# Altium project T1-T0ast.X1.PrjPcb (part 1 of 2)
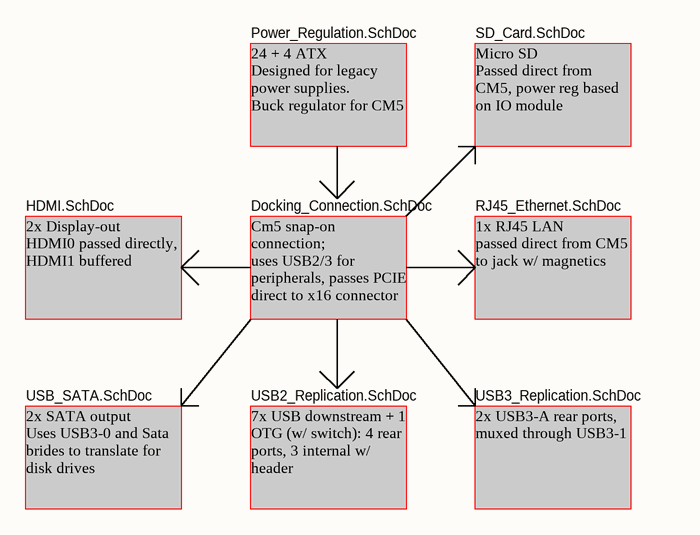
[diagram p0: Block Diagram.SchDoc]
9 sheets, 380 parts. Net scope: global (net labels, ports and power ports of the same name join across sheets).
Board file: T1-T0ast.PcbDoc
Sheets:
  Block Diagram.SchDoc
    12VDC, 5VDC, 5VDC. 3VDC, 1.2VDC = Power_Regulation.SchDoc
    12VDC, 5VDC, 5VDC. 3VDC, 1.2VDC = USB2_Replication.SchDoc
    12VDC, 5VDC, 5VDC. 3VDC, 1.2VDC = Docking_Connection.SchDoc
    12VDC, 5VDC, 5VDC. 3VDC, 1.2VDC = RJ45_Ethernet.SchDoc
    12VDC, 5VDC, 5VDC. 3VDC, 1.2VDC = HDMI.SchDoc
    12VDC, 5VDC, 5VDC. 3VDC, 1.2VDC = USB_SATA.SchDoc
    12VDC, 5VDC, 5VDC. 3VDC, 1.2VDC = USB3_Replication.SchDoc
  USB_Audio.SchDoc

## Sheet Block Diagram.SchDoc
size A; SheetNumber: 1; SheetTotal: 9; CompanyName: Gamber-Johnson LLC; Organization: CD Cell

### Sub-sheets
12VDC, 5VDC, 5VDC. 3VDC, 1.2VDC = Power_Regulation.SchDoc: no entries
12VDC, 5VDC, 5VDC. 3VDC, 1.2VDC = USB2_Replication.SchDoc: no entries
12VDC, 5VDC, 5VDC. 3VDC, 1.2VDC = Docking_Connection.SchDoc: no entries
12VDC, 5VDC, 5VDC. 3VDC, 1.2VDC = RJ45_Ethernet.SchDoc: no entries
12VDC, 5VDC, 5VDC. 3VDC, 1.2VDC = HDMI.SchDoc: no entries
12VDC, 5VDC, 5VDC. 3VDC, 1.2VDC = USB_SATA.SchDoc: no entries
12VDC, 5VDC, 5VDC. 3VDC, 1.2VDC = SD_Card.SchDoc (file not in this document): no entries
12VDC, 5VDC, 5VDC. 3VDC, 1.2VDC = USB3_Replication.SchDoc: no entries

### Notes on the sheet
- 24 + 4 ATX
  Designed for legacy power supplies.
  Buck regulator for CM5
- Micro SD
  Passed direct from CM5, power reg based on IO module
- 2x Display-out
  HDMI0 passed directly, HDMI1 buffered
- Cm5 snap-on connection;
  uses USB2/3 for peripherals, passes PCIE direct to x16 connector
- 1x RJ45 LAN
  passed direct from CM5 to jack w/ magnetics
- 2x SATA output
  Uses USB3-0 and Sata brides to translate for disk drives
- 7x USB downstream + 1 OTG (w/ switch): 4 rear ports, 3 internal w/ header
- 2x USB3-A rear ports, muxed through USB3-1
- REV
- REVISIONS
- DATE
- DESCRIPTION
- BY
- UNLESS OTHERWISE SPECIFIED, DRAWING DEFINITIONS AND TOLERANCES SHALL BE FOUND UNDER SUPPLIER STANDARDS SS-001. THIS PART AND ALL COMPONENTS OF IT MUST BE RoHS & REACH COMPLIANT. A CERTIFICATE OF COMPLIANCE MUST BE PROVIDED UPON REQUEST.
- ALL INFORMATION ON THIS DOCUMENT IS THE SOLE PROPERTY OF GAMBER-JOHNSON AND SHALL NOT BE COPIED, REPRODUCED, USED OR DISCLOSED IN WHOLE OR IN PART WITHOUT THE WRITTEN CONSENT OF GAMBER-JOHNSON
- TOLERANCES
  .00 ± .060
  .000 ± .020
  .0000 ± .005
  ANGELS ± 1°
- DRAWN BY:
- PROJECT NUMBER:
- SHEET TITLE:
- SHEET
- OF
- DATE:
- LOCATION:
- ASSEMBLY NUMBER
- SIZE
- GAMBER-JOHNSON LLC
  5001 Joerns Dr
  STEVENS POINT, WI 54481
  +1 (715) 344-5209
- A

## Sheet Power_Regulation.SchDoc
size A; SheetNumber: 2; SheetTotal: 10
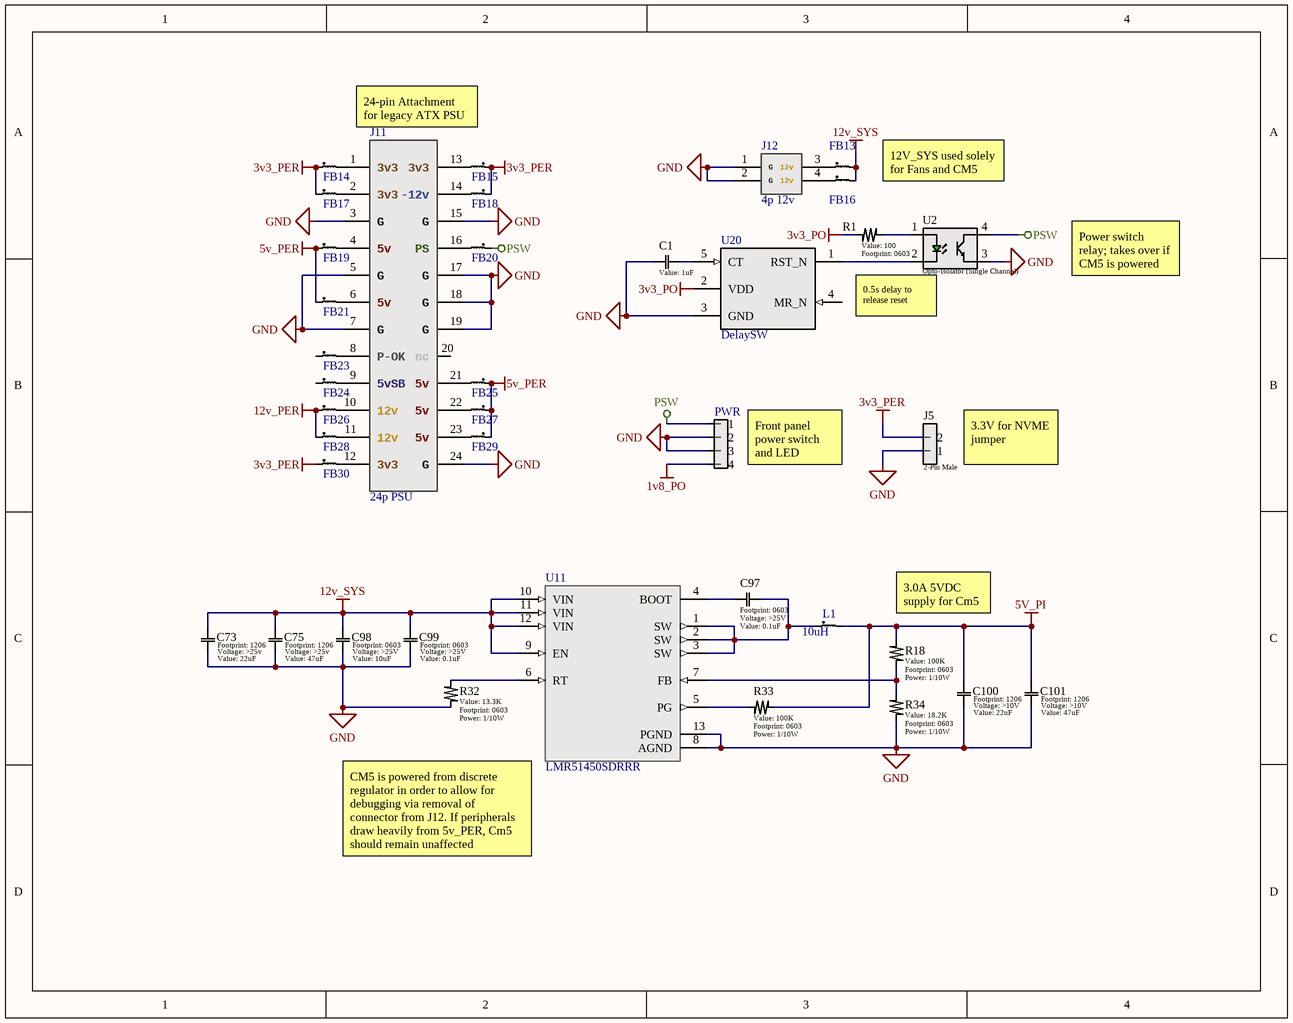
[diagram p1: Power_Regulation.SchDoc]

### Parts
C1  value 1uF  [0603]  (hidden comment: Generic Capacitor)
C73  value 22uF  Voltage: >25v  [1206]  (hidden comment: Generic Capacitor)
C75  value 47uF  Voltage: >25v  [1206]  (hidden comment: Generic Capacitor)
C97  value 0.1uF  Voltage: >25V  [0603]  (hidden comment: Generic Capacitor)
C98  value 10uF  Voltage: >25V  [0603]  (hidden comment: Generic Capacitor)
C99  value 0.1uF  Voltage: >25V  [0603]  (hidden comment: Generic Capacitor)
C100  value 22uF  Voltage: >10V  [1206]  (hidden comment: Generic Capacitor)
C101  value 47uF  Voltage: >10V  [1206]  (hidden comment: Generic Capacitor)
FB13  1206 Ferrite  [1206]  (value not drawn)
FB14  1206 Ferrite  [1206]  (value not drawn)
FB15  1206 Ferrite  [1206]  (value not drawn)
FB16  1206 Ferrite  [1206]  (value not drawn)
FB17  1206 Ferrite  [1206]  (value not drawn)
FB18  1206 Ferrite  [1206]  (value not drawn)
FB19  1206 Ferrite  [1206]  (value not drawn)
FB20  1206 Ferrite  [1206]  (value not drawn)
FB21  1206 Ferrite  [1206]  (value not drawn)
FB23  1206 Ferrite  [1206]  (value not drawn)
FB24  1206 Ferrite  [1206]  (value not drawn)
FB25  1206 Ferrite  [1206]  (value not drawn)
FB26  1206 Ferrite  [1206]  (value not drawn)
FB27  1206 Ferrite  [1206]  (value not drawn)
FB28  1206 Ferrite  [1206]  (value not drawn)
FB29  1206 Ferrite  [1206]  (value not drawn)
FB30  1206 Ferrite  [1206]  (value not drawn)
J5  2-Pin Male  [0022057025]
J11  24p PSU  [CONN_442060007_MOL]
J12  4p 12v  [CON_39281043]
L1  10uH  [SMD 8.2x8.6mm]
PWR  4-Pin Male Header (0.100" Pitch)  [TSW-104-07-T-S]  (value not drawn)
R1  value 100  [0603]  (hidden comment: Generic Resistor)
R18  value 100K  Power: 1/10W  [0603]  (hidden comment: Generic Resistor)
R32  value 13.3K  Power: 1/10W  [0603]  (hidden comment: Generic Resistor)
R33  value 100K  Power: 1/10W  [0603]  (hidden comment: Generic Resistor)
R34  value 18.2K  Power: 1/10W  [0603]  (hidden comment: Generic Resistor)
U2  Opto-Isolator (Single Channel)  [4-SMD (7.62mm Gull-Wing) Opto-Transistor]
U11  LMR51450SDRRR  [WSON-12]
U20  DelaySW  [TSOT-23-5]

### Nets
1v8_PO: PWR.4
3v3_PER: FB14.1 FB15.1 FB17.1 FB18.1 FB30.1 J5.2
3v3_PO: R1.1 U20.2(VDD)
5v_PER: FB19.1 FB21.1 FB25.1 FB27.1 FB29.1
5V_PI: C100.1 C101.1 L1.2 R18.2 R33.1
12v_PER: FB26.1 FB28.1
12v_SYS: C73.1 C75.1 C98.1 C99.1 FB13.2 FB16.2 U11.9(EN) U11.10(VIN) U11.11(VIN) U11.12(VIN)
GND: C1.2 C73.2 C75.2 C98.2 C99.2 C100.2 C101.2 J5.1 J11.3(G) J11.5(G) J11.7(G) J11.15(G) J11.17(G) J11.18(G) J11.19(G) J11.24(G) J12.1(G) J12.2(G) PWR.2 PWR.3 R32.1 R34.1 U2.3 U11.8(AGND) U11.13(PGND) U20.3(GND)
PSW: FB20.1 PWR.1 U2.4
NetC1_1: C1.1 U20.5(CT)
NetC97_1: C97.1 U11.4(BOOT)
NetC97_2: C97.2 L1.1 U11.1(SW) U11.2(SW) U11.3(SW)
NetFB13_1: FB13.1 J12.3(12v)
NetFB14_2: FB14.2 J11.1(3v3)
NetFB15_2: FB15.2 J11.13(3v3)
NetFB16_1: FB16.1 J12.4(12v)
NetFB17_2: FB17.2 J11.2(3v3)
NetFB18_2: FB18.2 J11.14(-12v)
NetFB19_2: FB19.2 J11.4(5v)
NetFB20_2: FB20.2 J11.16(PS)
NetFB21_2: FB21.2 J11.6(5v)
NetFB23_2: FB23.2 J11.8(P-OK)
NetFB24_2: FB24.2 J11.9(5vSB)
NetFB25_2: FB25.2 J11.21(5v)
NetFB26_2: FB26.2 J11.10(12v)
NetFB27_2: FB27.2 J11.22(5v)
NetFB28_2: FB28.2 J11.11(12v)
NetFB29_2: FB29.2 J11.23(5v)
NetFB30_2: FB30.2 J11.12(3v3)
NetR1_2: R1.2 U2.1
NetR18_1: R18.1 R34.2 U11.7(FB)
NetR32_2: R32.2 U11.6(RT)
NetR33_2: R33.2 U11.5(PG)
NetU2_2: U2.2 U20.1(RST_N)

Not connected (* = marked no-connect by the designer): FB23 1; FB24 1; J11 20(nc); U20 4(MR_N)

### Notes on the sheet
- 24-pin Attachment for legacy ATX PSU
- 12V_SYS used solely for Fans and CM5
- Power switch relay; takes over if CM5 is powered
- (near U2) 0.5s delay to release reset
- (near PWR) Front panel power switch and LED
- (near J5) 3.3V for NVME jumper
- (near R18) 3.0A 5VDC supply for Cm5
- (near U11) CM5 is powered from discrete regulator in order to allow for debugging via removal of connector from J12. If peripherals draw heavily from 5v_PER, Cm5 should remain unaffected
- REV
- REVISIONS
- DATE
- DESCRIPTION
- BY
- UNLESS OTHERWISE SPECIFIED, DRAWING DEFINITIONS AND TOLERANCES SHALL BE FOUND UNDER SUPPLIER STANDARDS SS-001. THIS PART AND ALL COMPONENTS OF IT MUST BE RoHS & REACH COMPLIANT. A CERTIFICATE OF COMPLIANCE MUST BE PROVIDED UPON REQUEST.
- ALL INFORMATION ON THIS DOCUMENT IS THE SOLE PROPERTY OF GAMBER-JOHNSON AND SHALL NOT BE COPIED, REPRODUCED, USED OR DISCLOSED IN WHOLE OR IN PART WITHOUT THE WRITTEN CONSENT OF GAMBER-JOHNSON
- TOLERANCES
  .00 ± .060
  .000 ± .020
  .0000 ± .005
  ANGELS ± 1°
- DRAWN BY:
- PROJECT NUMBER:
- SHEET TITLE:
- SHEET
- OF
- DATE:
- LOCATION:
- ASSEMBLY NUMBER
- SIZE
- GAMBER-JOHNSON LLC
  5001 JOERNS DR.
  STEVENS POINT, WI 54481
  +1 (715) 344-5209
- B

### Library data of the parts
C1 = Generic Capacitor: Voltage: 10V; Tolerance: 10%
C73 C75 C100 = Generic Capacitor: Tolerance: 20%
C97-C99 C101 = Generic Capacitor: Tolerance: 10%
FB13-FB21 FB23-FB30 = HI1206T161R-10: 160 Ohms @ 100MHz 1 Power, Signal Line Ferrite Bead 1206 (3216 Metric) 6A 18mOhm; Manufacturer 1: Laird Steward; DC Resistance (DCR): 18mR; Number of Lines: 1; Impedance: 160R; Supplier 1: Digi-Key; Manufacturer Part Number 1: HI1206T161R-10; RoHS: Yes; Category: Fixed Inductors; Stock 1: 250713; Pricing 1: 1=0.20000, 10=0.15600, 25=0.12920, 50=0.11140, 100=0.10020, 250=0.08464, 500=0.07572, 1000=0.06458 (USD); Mount: Surface Mount; Case/Package: 1206; Weight: 0.0136oz; Case Code (Metric): 3216; Case Code (Imperial): 1206; Core Material: Ferrite; Material: Ferrite; Min Operating Temperature: -40°C; Max Operating Temperature: 125°C; Package Quantity: 1; Packaging: Tape and Reel; Max Current Rating: 6A; Current Rating: 6A; Max DC Current: 6A; Termination: SMD/SMT; Frequency: 100MHz; Test Frequency: 100MHz; Length: 3.2mm; Height: 0.071inch; Width: 0.063inch; Depth: 1.8mm; Lead Free: Lead Free; REACH SVHC: Unknown; ComponentLink1URL: https://datasheet.ciiva.com/22622/1685743-22622771.pdf?src-supplier=Element14; ComponentLink1Description: https://datasheet.ciiva.com/22622/1685743-22622771.pdf?src-supplier=Element14; ComponentLink2URL: https://datasheet.ciiva.com/16714/70065439-16714326.pdf?src-supplier=Allied+Electronics; ComponentLink2Description: https://datasheet.ciiva.com/16714/70065439-16714326.pdf?src-supplier=Allied+Electronics; Supplier Part Number 1: 240-2411-1-ND; LCSC PN: C2926396
J5 = 0022057025: Conn Shrouded Header (4 Sides) HDR 2 POS 2.5mm Solder RA Thru-Hole SPOX™ Bag; Manufacturer 1: Molex; Number of Poles: 2; Voltage Rating: 250V; Contact Resistance: 20mR; Max Voltage Rating (DC): 250.25kV; Max Voltage Rating (AC): 125V; Current Rating: 3A; Insulation Resistance: 1GR; Connector Type: Male Pin; Shrouded: Yes (With); Test Voltage: 1kV; Glow Wire Compliant: Non-compliant; Supplier 1: RSComponents; Manufacturer Part Number 1: 22-05-7025; RoHS: Yes; Category: Headers and Wire Housings; Stock 1: 1440; Pricing 1: 10=0.40100, 250=0.36000, 1000=0.24900, 5000=0.22200, 10000=0.20700 (USD); Mount: Through Hole,Surface Mount; Contact Plating: Tin,Copper; Contact Material: Brass,Bronze; Housing Color: Natural; Housing Material: Nylon; Color: Natural; Material: Nylon,Polyamide; Insulation Material: Nylon; Min Operating Temperature: -40°C; Max Operating Temperature: 105°C; Packaging: Bulk; Gender: Male; Number of Rows: 1; Termination: Solder; Number of Contacts: 2; Orientation: Right Angle; Package Quantity: 1; Voltage Rating (AC): 250V; Number of Positions: 2; Working Voltage: 250V; Voltage Rating (DC): 250V; Number of Circuits: 2; Contact Gender: Male; Series: SPOX™ 5268; Contact Type: Male Pin; Length: 7.65mm; Height: 5.7mm; Pitch: 2.5mm; Depth: 5.1mm; Lead Pitch: 2.5mm; Contact Mating Length: 0.138inch; Radiation Hardening: No; RoHS Compliant: Yes; REACH SVHC: Unknown; Lead Free: Lead Free; Flammability Rating: UL94 V-0; ComponentLink1URL: https://datasheet.ciiva.com/711/022057025-sd-711958.pdf?src-supplier=Digi-Key; ComponentLink1Description: https://datasheet.ciiva.com/711/022057025-sd-711958.pdf?src-supplier=Digi-Key; ComponentLink2URL: https://datasheet.ciiva.com/25265/1766960-25265813.pdf?src-supplier=Newark; ComponentLink2Description: https://datasheet.ciiva.com/25265/1766960-25265813.pdf?src-supplier=Newark; ComponentLink3URL: https://datasheet.ciiva.com/5155/0022057025-pcb-headers-158480-5155683.pdf?src-supplier=Mouser; ComponentLink3Description: https://datasheet.ciiva.com/5155/0022057025-pcb-headers-158480-5155683.pdf?src-supplier=Mouser; ComponentLink4URL: https://datasheet.ciiva.com/19461/2017869-19461071.pdf?src-supplier=Jameco; ComponentLink4Description: https://datasheet.ciiva.com/19461/2017869-19461071.pdf?src-supplier=Jameco; ComponentLink5URL: https://datasheet.ciiva.com/11747/0900766b80da772b-11747276.pdf?src-supplier=RSComponents; ComponentLink5Description: https://datasheet.ciiva.com/11747/0900766b80da772b-11747276.pdf?src-supplier=RSComponents; ComponentLink6URL: https://datasheet.ciiva.com/7920/1877911-7920684.pdf?src-supplier=Element14; ComponentLink6Description: https://datasheet.ciiva.com/7920/1877911-7920684.pdf?src-supplier=Element14; ComponentLink7URL: https://datasheet.ciiva.com/9468/0022057025-pcb-headers-9468379.pdf?src-supplier=Avnet; ComponentLink7Description: https://datasheet.ciiva.com/9468/0022057025-pcb-headers-9468379.pdf?src-supplier=Avnet; Supplier Part Number 1: 6878086; LCSC PN: C918490
J11 = 442060007: Connector Header Through Hole 24 position 0.165" (4.20mm); Mfr_Name: Molex Connector Corporation; RefDes: RefDes; Type: Type; Supplier 1: Mouser; Supplier Part Number 1: 538-44206-0007; LCSC PN: C7541562
J12 = 39281043: Connector Header Through Hole 4 position 0.165" (4.20mm); Mfr_Name: Molex Connector Corporation; RefDes: RefDes; Type: Type; Supplier 1: Avnet; Supplier Part Number 1: 0039281043; LCSC PN: C2845777
L1 = IHLP3232DZER100M5A: 5.1A 10uH ±20% 5.2A - Power Inductor; Mfr_Name: Vishay; Type: DEV; Copyright: Copyright (C) 2023 Ultra Librarian. All rights reserved.; Manufacturer_Part_Number: IHLP3232DZER100M5A; RefDes: RefDes; LCSC PN: C2051768; Supplier 1: Mouser
PWR = TSW-104-07-T-S: Connector Header Through Hole 4 position 0.100" (2.54mm); Manufacturer 1: Samtec; Manufacturer Part Number 1: MTSW-104-07-T-S-170; Number of Contacts: 4; Supplier 1: Avnet; RoHS: Yes; Category: Connectors; Mount: Through Hole; Contact Plating: Tin; Contact Material: Bronze; Min Operating Temperature: -55°C; Max Operating Temperature: 105°C; Number of Rows: 1; Termination: Solder; Gender: Male; Packaging: Bulk; Orientation: Vertical; Pitch: 2.54mm; Radiation Hardening: No; RoHS Compliant: Yes; Lead Free: Lead Free; ComponentLink1URL: http://www.samtec.com/documents/webfiles/pdf/HMTSW.PDF?src-supplier=Avnet; ComponentLink1Description: http://www.samtec.com/documents/webfiles/pdf/HMTSW.PDF?src-supplier=Avnet; Supplier Part Number 1: MTSW-104-07-T-S-170
R1 = Generic Resistor: Tolerance: 1%; Power: 1/10W
R18 R32-R34 = Generic Resistor: Tolerance: 1%
U2 = LTV-816S: LTV Series Single Channel 80 V 5000 Vrms Transistor Output Optocoupler SMT-DIP-4; Manufacturer: Vishay Lite-On; Manufacturer Part Number: LTV-816S-TA1; Number of Channels: 1; Forward Voltage: 1.4V; Collector Emitter Voltage (VCEO): 80V; Rise Time: 18000ns; Output Current per Channel: 50mA; Collector Emitter Saturation Voltage: 200mV; Current Transfer Ratio: 320%; Isolation Voltage: 5kV; Input Type: DC; Max Power Dissipation: 200mW; Reverse Breakdown Voltage: 6V; Supplier 1: Digi-Key; RoHS: Yes; Category: Optocouplers; Stock 1: 2; Pricing 1: 1=0.45000, 10=0.27600, 100=0.15870 (USD); Mount: Surface Mount; Case/Package: SMD/SMT; Number of Pins: 4; Min Operating Temperature: -50°C; Max Operating Temperature: 110°C; Max Output Voltage: 80V; Packaging: Tape and Reel; Forward Current: 50mA; Fall Time: 18000ns; Max Input Current: 50mA; Collector-emitter Voltage-Max: 200mV; Series: -; Max Collector Current: 50mA; Number of Elements: 1; Power Dissipation: 200mW; Package Quantity: 1000; Output Voltage: 80V; Number of Circuits: 1; Isolation Voltage-Max: 5kV; Radiation Hardening: No; RoHS Compliant: Yes; Lead Free: Lead Free; ComponentLink1URL: https://datasheet.ciiva.com/15119/getdatasheetpartid-317372-15119066.pdf?src-supplier=Verical; ComponentLink1Description: https://datasheet.ciiva.com/15119/getdatasheetpartid-317372-15119066.pdf?src-supplier=Verical; ComponentLink2URL: https://datasheet.ciiva.com/6573/s-110-ltv-816826846m-s-s-ta-s-ta1-s-tpseries-6573992.pdf?src-supplier=Digi-Key; ComponentLink2Description: https://datasheet.ciiva.com/6573/s-110-ltv-816826846m-s-s-ta-s-ta1-s-tpseries-6573992.pdf?src-supplier=Digi-Key; ComponentLink3URL: https://datasheet.ciiva.com/6573/s-110-ltv-816826846m-s-s-ta-s-ta1-s-tpseries-6573991.pdf?src-supplier=Digi-Key; ComponentLink3Description: https://datasheet.ciiva.com/6573/s-110-ltv-816826846m-s-s-ta-s-ta1-s-tpseries-6573991.pdf?src-supplier=Digi-Key; ComponentLink4URL: https://datasheet.ciiva.com/6573/s-110-ltv-816826846m-s-s-ta-s-ta1-s-tpseries-6573993.pdf?src-supplier=Digi-Key; ComponentLink4Description: https://datasheet.ciiva.com/6573/s-110-ltv-816826846m-s-s-ta-s-ta1-s-tpseries-6573993.pdf?src-supplier=Digi-Key; Supplier Part Number 1: 160-1892-1-ND; LCSC PN: C92647
U11 = LMR51450SDRRR: 36-V, 5-A synchronous buck converter; MF: Texas Instruments; SnapEDA_Link: https://www.snapeda.com/parts/LMR51450SDRRR/Texas+Instruments/view-part/?ref=snap; Package: WSON-12 Texas Instruments; Value: *; MP: LMR51450SDRRR; Check_prices: https://www.snapeda.com/parts/LMR51450SDRRR/Texas+Instruments/view-part/?ref=eda; LCSC PN: C6890985
U20 = TPS3840DL22DBVR: Supervisor Open Drain or Open Collector 1 Channel SOT-23-5 / 2.2V Threshold; Mfr_Name: Texas Instruments; TYPE: TYPE; RefDes: RefDes; LCSC PN: C2867913; Supplier 1: Mouser; Supplier Part Number 1: 595-TPS3840DL22DBVR

## Sheet USB2_Replication.SchDoc
size B; SheetNumber: 4; SheetTotal: 10
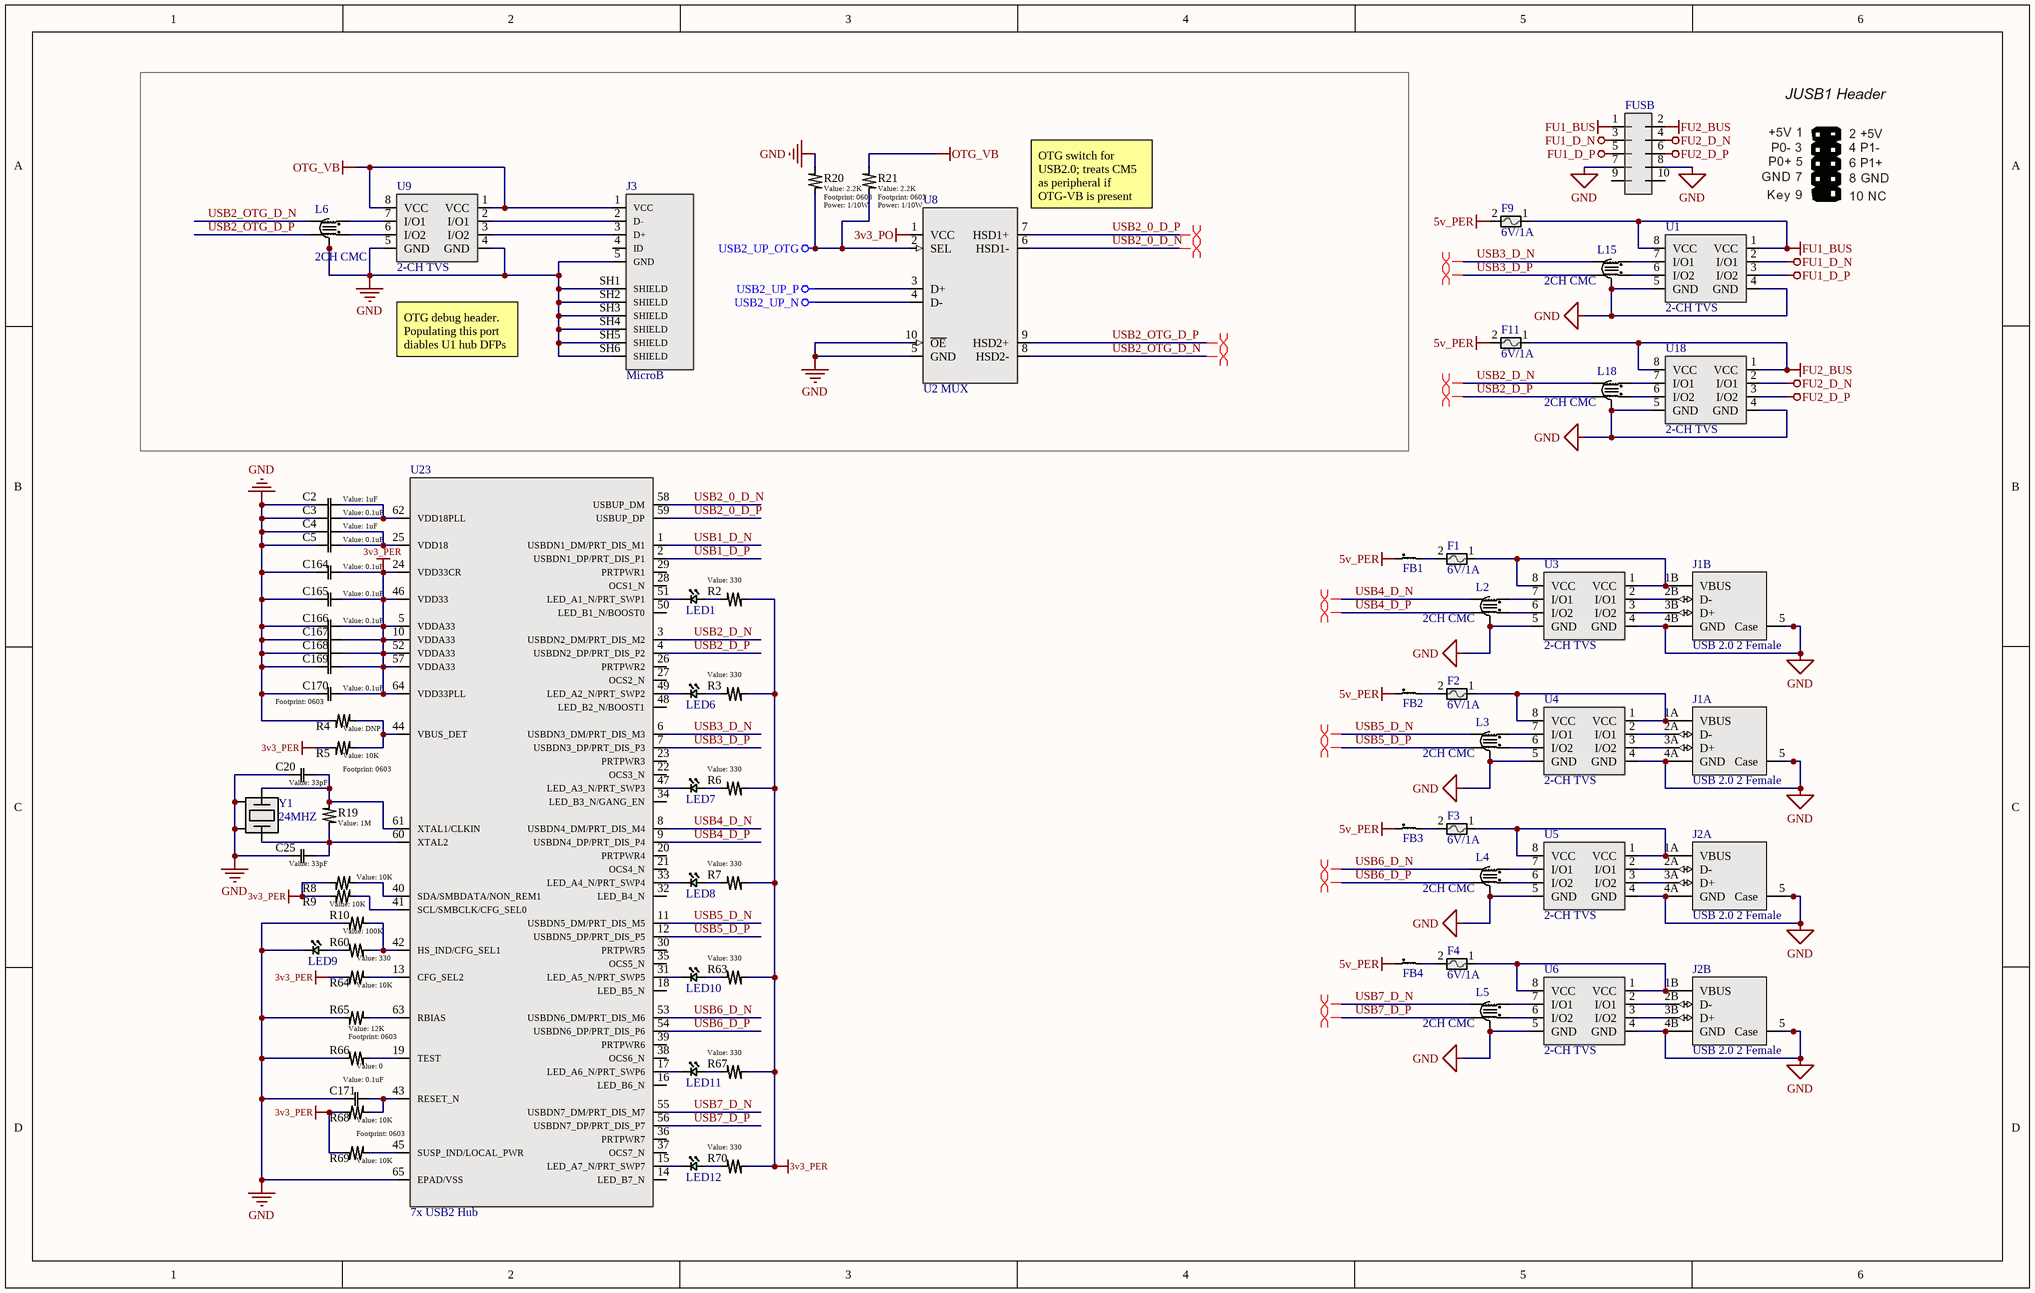
[diagram p2: USB2_Replication.SchDoc]

### Parts
C2  value 1uF  [0603]  (hidden comment: Generic Capacitor)
C3  value 0.1uF  [0603]  (hidden comment: Generic Capacitor)
C4  value 1uF  [0603]  (hidden comment: Generic Capacitor)
C5  value 0.1uF  [0603]  (hidden comment: Generic Capacitor)
C20  value 33pF  [0603]  (hidden comment: Generic Capacitor)
C25  value 33pF  [0603]  (hidden comment: Generic Capacitor)
C164  value 0.1uF  [0603]  (hidden comment: Generic Capacitor)
C165  value 0.1uF  [0603]  (hidden comment: Generic Capacitor)
C166  value 0.1uF  [0603]  (hidden comment: Generic Capacitor)
C167  Generic Capacitor  [0603]  (value not drawn)
C168  Generic Capacitor  [0603]  (value not drawn)
C169  Generic Capacitor  [0603]  (value not drawn)
C170  value 0.1uF  [0603]  (hidden comment: Generic Capacitor)
C171  value 0.1uF  [0603]  (hidden comment: Generic Capacitor)
F1  6V/1A  [0805]
F2  6V/1A  [0805]
F3  6V/1A  [0805]
F4  6V/1A  [0805]
F9  6V/1A  [0805]
F11  6V/1A  [0805]
FB1  0603 Ferrite  [0603]  (value not drawn)
FB2  0603 Ferrite  [0603]  (value not drawn)
FB3  0603 Ferrite  [0603]  (value not drawn)
FB4  0603 Ferrite  [0603]  (value not drawn)
FUSB  10pinMobo  [10pinMobo]  (value not drawn)
J1  USB 2.0 2 Female  [907-111A1022D10200]  (parts A,B of 2)
J2  USB 2.0 2 Female  [907-111A1022D10200]  (parts A,B of 2)
J3  MicroB  [10118194-0001LF]
L2  2CH CMC  [SMD-6-2CH]
L3  2CH CMC  [SMD-6-2CH]
L4  2CH CMC  [SMD-6-2CH]
L5  2CH CMC  [SMD-6-2CH]
L6  2CH CMC  [SMD-6-2CH]
L15  2CH CMC  [SMD-6-2CH]
L18  2CH CMC  [SMD-6-2CH]
LED1  LTST-C191KGKT  [0603 (1608 Metric) Concave]  (value not drawn)
LED6  LTST-C191KGKT  [0603 (1608 Metric) Concave]  (value not drawn)
LED7  LTST-C191KGKT  [0603 (1608 Metric) Concave]  (value not drawn)
LED8  LTST-C191KGKT  [0603 (1608 Metric) Concave]  (value not drawn)
LED9  LTST-C191KGKT  [0603 (1608 Metric) Concave]  (value not drawn)
LED10  LTST-C191KGKT  [0603 (1608 Metric) Concave]  (value not drawn)
LED11  LTST-C191KGKT  [0603 (1608 Metric) Concave]  (value not drawn)
LED12  LTST-C191KGKT  [0603 (1608 Metric) Concave]  (value not drawn)
R2  value 330  [0603]  (hidden comment: Generic Resistor)
R3  value 330  [0603]  (hidden comment: Generic Resistor)
R4  value DNP  [0603]  (hidden comment: Generic Resistor)
R5  value 10K  [0603]  (hidden comment: Generic Resistor)
R6  value 330  [0603]  (hidden comment: Generic Resistor)
R7  value 330  [0603]  (hidden comment: Generic Resistor)
R8  value 10K  [0603]  (hidden comment: Generic Resistor)
R9  value 10K  [0603]  (hidden comment: Generic Resistor)
R10  value 100K  [0603]  (hidden comment: Generic Resistor)
R19  value 1M  [0603]  (hidden comment: Generic Resistor)
R20  value 2.2K  Power: 1/10W  [0603]  (hidden comment: Generic Resistor)
R21  value 2.2K  Power: 1/10W  [0603]  (hidden comment: Generic Resistor)
R60  value 330  [0603]  (hidden comment: Generic Resistor)
R63  value 330  [0603]  (hidden comment: Generic Resistor)
R64  value 10K  [0603]  (hidden comment: Generic Resistor)
R65  value 12K  [0603]  (hidden comment: Generic Resistor)
R66  value 0  [0603]  (hidden comment: Generic Resistor)
R67  value 330  [0603]  (hidden comment: Generic Resistor)
R68  value 10K  [0603]  (hidden comment: Generic Resistor)
R69  value 10K  [0603]  (hidden comment: Generic Resistor)
R70  value 330  [0603]  (hidden comment: Generic Resistor)
U1  2-CH TVS  [8-SOIC]
U3  2-CH TVS  [8-SOIC]
U4  2-CH TVS  [8-SOIC]
U5  2-CH TVS  [8-SOIC]
U6  2-CH TVS  [8-SOIC]
U8  U2 MUX  [MSOP-10]
U9  2-CH TVS  [8-SOIC]
U18  2-CH TVS  [8-SOIC]
U23  7x USB2 Hub  [QFN-64]
Y1  24MHZ  [SMD2520-4P]

### Nets
3v3_PER: C164.1 C165.1 C166.1 C167.1 C168.1 C169.1 C170.1 R2.2 R3.2 R5.1 R6.2 R7.2 R8.1 R9.1 R63.2 R64.1 R67.2 R68.1 R69.1 R70.2 U23.5(VDDA33) U23.10(VDDA33) U23.24(VDD33CR) U23.46(VDD33) U23.52(VDDA33) U23.57(VDDA33) U23.64(VDD33PLL)
3v3_PO: U8.1(VCC)
5v_PER: F9.2 F11.2 FB1.1 FB2.1 FB3.1 FB4.1
FU1_BUS: F9.1 FUSB.1 U1.1(VCC) U1.8(VCC)
FU1_D_N: FUSB.3 U1.2(I/O1)
FU1_D_P: FUSB.5 U1.3(I/O2)
FU2_BUS: F11.1 FUSB.2 U18.1(VCC) U18.8(VCC)
FU2_D_N: FUSB.4 U18.2(I/O1)
FU2_D_P: FUSB.6 U18.3(I/O2)
GND: C2.2 C3.2 C4.2 C5.2 C20.2 C25.2 C164.2 C165.2 C166.2 C167.2 C168.2 C169.2 C170.2 C171.2 FUSB.7 FUSB.8 J1.4A(GND) J1.4B(GND) J1.5(Case) J2.4A(GND) J2.4B(GND) J2.5(Case) J3.5(GND) J3.SH1(SHIELD) J3.SH2(SHIELD) J3.SH3(SHIELD) J3.SH4(SHIELD) J3.SH5(SHIELD) J3.SH6(SHIELD) L2.5 L2.6 L3.5 L3.6 L4.5 L4.6 L5.5 L5.6 L6.5 L6.6 L15.5 L15.6 L18.5 L18.6 LED9.1(Cathode) R4.1 R10.1 R20.1 R65.1 R66.1 U1.4(GND) U1.5(GND) U3.4(GND) U3.5(GND) U4.4(GND) U4.5(GND) U5.4(GND) U5.5(GND) U6.4(GND) U6.5(GND) U8.5(GND) U8.10(~{OE}) U9.4(GND) U9.5(GND) U18.4(GND) U18.5(GND) U23.65(EPAD/VSS) Y1.2(GND) Y1.4(GND)
OTG_VB: J3.1(VCC) R21.1 U9.1(VCC) U9.8(VCC)
USB2_UP_N: U8.4(D-)
USB2_UP_OTG: R20.2 R21.2 U8.2(SEL)
USB2_UP_P: U8.3(D+)
USB1_D_N: U23.1(USBDN1_DM/PRT_DIS_M1)
USB1_D_P: U23.2(USBDN1_DP/PRT_DIS_P1)
USB2_0_D_N: U8.6(HSD1-) U23.58(USBUP_DM)
USB2_0_D_P: U8.7(HSD1+) U23.59(USBUP_DP)
USB2_D_N: L18.4 U23.3(USBDN2_DM/PRT_DIS_M2)
USB2_D_P: L18.3 U23.4(USBDN2_DP/PRT_DIS_P2)
USB2_OTG_D_N: L6.4 U8.8(HSD2-)
USB2_OTG_D_P: L6.3 U8.9(HSD2+)
USB3_D_N: L15.4 U23.6(USBDN3_DM/PRT_DIS_M3)
USB3_D_P: L15.3 U23.7(USBDN3_DP/PRT_DIS_P3)
USB4_D_N: L2.4 U23.8(USBDN4_DM/PRT_DIS_M4)
USB4_D_P: L2.3 U23.9(USBDN4_DP/PRT_DIS_P4)
USB5_D_N: L3.4 U23.11(USBDN5_DM/PRT_DIS_M5)
USB5_D_P: L3.3 U23.12(USBDN5_DP/PRT_DIS_P5)
USB6_D_N: L4.4 U23.53(USBDN6_DM/PRT_DIS_M6)
USB6_D_P: L4.3 U23.54(USBDN6_DP/PRT_DIS_P6)
USB7_D_N: L5.4 U23.55(USBDN7_DM/PRT_DIS_M7)
USB7_D_P: L5.3 U23.56(USBDN7_DP/PRT_DIS_P7)
NetC2_1: C2.1 C3.1 U23.62(VDD18PLL)
NetC4_1: C4.1 C5.1 U23.25(VDD18)
NetC20_1: C20.1 R19.1 U23.61(XTAL1/CLKIN) Y1.1
NetC25_1: C25.1 R19.2 U23.60(XTAL2) Y1.3
NetC171_1: C171.1 R68.2 U23.43(RESET_N)
NetF1_1: F1.1 J1.1B(VBUS) U3.1(VCC) U3.8(VCC)
NetF1_2: F1.2 FB1.2
NetF2_1: F2.1 J1.1A(VBUS) U4.1(VCC) U4.8(VCC)
NetF2_2: F2.2 FB2.2
NetF3_1: F3.1 J2.1A(VBUS) U5.1(VCC) U5.8(VCC)
NetF3_2: F3.2 FB3.2
NetF4_1: F4.1 J2.1B(VBUS) U6.1(VCC) U6.8(VCC)
NetF4_2: F4.2 FB4.2
NetJ1_2A: J1.2A(D-) U4.2(I/O1)
NetJ1_2B: J1.2B(D-) U3.2(I/O1)
NetJ1_3A: J1.3A(D+) U4.3(I/O2)
NetJ1_3B: J1.3B(D+) U3.3(I/O2)
NetJ2_2A: J2.2A(D-) U5.2(I/O1)
NetJ2_2B: J2.2B(D-) U6.2(I/O1)
NetJ2_3A: J2.3A(D+) U5.3(I/O2)
NetJ2_3B: J2.3B(D+) U6.3(I/O2)
NetJ3_2: J3.2(D-) U9.2(I/O1)
NetJ3_3: J3.3(D+) U9.3(I/O2)
NetL2_1: L2.1 U3.7(I/O1)
NetL2_2: L2.2 U3.6(I/O2)
NetL3_1: L3.1 U4.7(I/O1)
NetL3_2: L3.2 U4.6(I/O2)
NetL4_1: L4.1 U5.7(I/O1)
NetL4_2: L4.2 U5.6(I/O2)
NetL5_1: L5.1 U6.7(I/O1)
NetL5_2: L5.2 U6.6(I/O2)
NetL6_1: L6.1 U9.7(I/O1)
NetL6_2: L6.2 U9.6(I/O2)
NetL15_1: L15.1 U1.7(I/O1)
NetL15_2: L15.2 U1.6(I/O2)
NetL18_1: L18.1 U18.7(I/O1)
NetL18_2: L18.2 U18.6(I/O2)
NetLED1_1: LED1.1(Cathode) U23.51(LED_A1_N/PRT_SWP1)
NetLED1_2: LED1.2(Anode) R2.1
NetLED6_1: LED6.1(Cathode) U23.49(LED_A2_N/PRT_SWP2)
NetLED6_2: LED6.2(Anode) R3.1
NetLED7_1: LED7.1(Cathode) U23.47(LED_A3_N/PRT_SWP3)
NetLED7_2: LED7.2(Anode) R6.1
NetLED8_1: LED8.1(Cathode) U23.33(LED_A4_N/PRT_SWP4)
NetLED8_2: LED8.2(Anode) R7.1
NetLED9_2: LED9.2(Anode) R60.1
NetLED10_1: LED10.1(Cathode) U23.31(LED_A5_N/PRT_SWP5)
NetLED10_2: LED10.2(Anode) R63.1
NetLED11_1: LED11.1(Cathode) U23.17(LED_A6_N/PRT_SWP6)
NetLED11_2: LED11.2(Anode) R67.1
NetLED12_1: LED12.1(Cathode) U23.15(LED_A7_N/PRT_SWP7)
NetLED12_2: LED12.2(Anode) R70.1
NetR4_2: R4.2 R5.2 U23.44(VBUS_DET)
NetR8_2: R8.2 U23.40(SDA/SMBDATA/NON_REM1)
NetR9_2: R9.2 U23.41(SCL/SMBCLK/CFG_SEL0)
NetR10_2: R10.2 R60.2 U23.42(HS_IND/CFG_SEL1)
NetR64_2: R64.2 U23.13(CFG_SEL2)
NetR65_2: R65.2 U23.63(RBIAS)
NetR66_2: R66.2 U23.19(TEST)
NetR69_2: R69.2 U23.45(SUSP_IND/LOCAL_PWR)

Not connected (* = marked no-connect by the designer): FUSB 9 10; J3 4(ID); U23 14(LED_B7_N) 16(LED_B6_N) 18(LED_B5_N) 20(PRTPWR4) 21(OCS4_N) 22(OCS3_N) 23(PRTPWR3) 26(PRTPWR2) 27(OCS2_N) 28(OCS1_N) 29(PRTPWR1) 30(PRTPWR5) 32(LED_B4_N) 34(LED_B3_N/GANG_EN) 35(OCS5_N) 36(PRTPWR7) 37(OCS7_N) 38(OCS6_N) 39(PRTPWR6) 48(LED_B2_N/BOOST1) 50(LED_B1_N/BOOST0)

### Layout directives
differential pair: USB2_0_D_N, USB2_0_D_P, USB2_D_N, USB2_D_P, USB2_OTG_D_N, USB2_OTG_D_P, USB3_D_N, USB3_D_P, USB4_D_N, USB4_D_P, USB5_D_N, USB5_D_P, USB6_D_N, USB6_D_P, USB7_D_N, USB7_D_P

### Notes on the sheet
- (near U8) OTG switch for USB2.0; treats CM5 as peripheral if OTG-VB is present
- OTG debug header. Populating this port diables U1 hub DFPs
- REV
- REVISIONS
- DATE
- DESCRIPTION
- BY
- UNLESS OTHERWISE SPECIFIED, DRAWING DEFINITIONS AND TOLERANCES SHALL BE FOUND UNDER SUPPLIER STANDARDS SS-001. THIS PART AND ALL COMPONENTS OF IT MUST BE RoHS & REACH COMPLIANT. A CERTIFICATE OF COMPLIANCE MUST BE PROVIDED UPON REQUEST.
- ALL INFORMATION ON THIS DOCUMENT IS THE SOLE PROPERTY OF GAMBER-JOHNSON AND SHALL NOT BE COPIED, REPRODUCED, USED OR DISCLOSED IN WHOLE OR IN PART WITHOUT THE WRITTEN CONSENT OF GAMBER-JOHNSON
- TOLERANCES
  .00 ± .060
  .000 ± .020
  .0000 ± .005
  ANGELS ± 1°
- DRAWN BY:
- PROJECT NUMBER:
- SHEET TITLE:
- SHEET
- OF
- DATE:
- LOCATION:
- ASSEMBLY NUMBER
- SIZE
- GAMBER-JOHNSON LLC
  5001 JOERNS DR.
  STEVENS POINT, WI 54481
  +1 (715) 344-5209
- B

### Library data of the parts
C2-C5 C20 C25 C164-C166 C170 C171 = Generic Capacitor: Voltage: 10V; Tolerance: 10%
C167-C169 = Generic Capacitor: Voltage: 10V; Tolerance: 10%; Value: 0.1uF
F1-F4 F9 F11 = 0ZCK0100FF2E: Polymeric PTC Resettable Fuse 6V 1 A Ih Surface Mount 0805 (2012 Metric), Concave; Manufacturer: Bel; Max Current Rating: 40A; Hold Current: 1A; Trip Current: 1.95A; Time to Trip: 0.3s; Supplier 1: Digi-Key; Supplier Part Number 1: 507-1815-1-ND; Manufacturer Part Number: 0ZCK0100FF2E; RoHS: Yes; Category: PTC Resettable Fuses; Stock 1: 74738; Pricing 1: 1=0.27000, 5=0.26600, 10=0.25400, 50=0.22620, 100=0.21060, 250=0.18720, 500=0.15600, 1000=0.14820 (USD); Mount: Surface Mount; Case/Package: 0805; Case Code (Metric): 2012; Case Code (Imperial): 0805; Contact Plating: Tin,Matte; Min Operating Temperature: -40°C; Max Operating Temperature: 85°C; Package Quantity: 1; Packaging: Tape and Reel; RoHS Compliant: Yes; ComponentLink1URL: https://datasheet.ciiva.com/18550/0zck-18550620.pdf?src-supplier=Digi-Key; ComponentLink1Description: https://datasheet.ciiva.com/18550/0zck-18550620.pdf?src-supplier=Digi-Key; ComponentLink2URL: https://datasheet.ciiva.com/18550/0zck-18550621.pdf?src-supplier=Digi-Key; ComponentLink2Description: https://datasheet.ciiva.com/18550/0zck-18550621.pdf?src-supplier=Digi-Key; ComponentLink3URL: https://datasheet.ciiva.com/18550/0zck-18550622.pdf?src-supplier=Digi-Key; ComponentLink3Description: https://datasheet.ciiva.com/18550/0zck-18550622.pdf?src-supplier=Digi-Key; LCSC PN: C883112
FB1-FB4 = PE-0603FB121ST: 120 Ohms @ 100 MHz 1 Signal Line Ferrite Bead 0603 (1608 Metric) 500mA 180mOhm; Manufacturer: Pulse; Number of Lines: 1; DC Resistance (DCR): 180mR; Supplier 1: Digi-Key; Supplier Part Number 1: 553-2382-1-ND; Manufacturer Part Number: PE-0603FB121ST; RoHS: Yes; Category: Inductors; Stock 1: 6181; Pricing 1: 1=0.10000, 10=0.04400, 25=0.03920, 50=0.03580, 100=0.03220, 250=0.02360, 500=0.01716, 1000=0.01680 (USD); Mount: Surface Mount; Case/Package: 0603; Case Code (Metric): 1608; Case Code (Imperial): 0603; Min Operating Temperature: -40°C; Max Operating Temperature: 105°C; Package Quantity: 4000; Packaging: Tape and Reel; Max Current Rating: 500mA; Length: 0.063inch; Width: 0.031inch; Height: 0.037inch; RoHS Compliant: Yes; ComponentLink1URL: https://productfinder.pulseeng.com/doc_type/WEB301/doc_num/WC706/doc_part/WC706.pdf?src-supplier=Digi-Key; ComponentLink1Description: https://productfinder.pulseeng.com/doc_type/WEB301/doc_num/WC706/doc_part/WC706.pdf?src-supplier=Digi-Key; ComponentLink2URL: http://productfinder.pulseeng.com/products/datasheets/WC706.pdf?src-supplier=Digi-Key; ComponentLink2Description: http://productfinder.pulseeng.com/products/datasheets/WC706.pdf?src-supplier=Digi-Key; LCSC PN: C275486
FUSB = 10pinMobo: 10pin motherboard jack
J1 J2 = 907-111A1022D10200: USB 2.0 2 8 Female Type-A Plugin USB Connectors ROHS; LCSC PN: C12049
J3 = 10118194-0001LF: Micro USB, Input Output Connectors, B TYPE RECEPTACLE with flange; MF: Amphenol ICC; SnapEDA_Link: https://www.snapeda.com/parts/10118194-0001LF/Amphenol+FCI/view-part/?ref=snap; Package: None; Value: *; MP: 10118194-0001LF; Check_prices: https://www.snapeda.com/parts/10118194-0001LF/Amphenol+FCI/view-part/?ref=eda; LCSC PN: C132563
L2-L6 L15 L18 = ICMEF112P350MFR: 35Ω@100MHz -40℃~+85℃ 4Ω 5V 2 100mA SMD Common Mode Filters ROHS; LCSC PN: C396460; Supplier 1: Mouser; Supplier Part Number 1: 710-748020024
LED1 LED6-LED12 = CMP-013-000000-1: LED Uni-Color Green 574nm 2-Pin Chip LED T/R; Manufacturer 1: Vishay Lite-On; Number of Elements: 1; Viewing Angle: 130°; Lens Transparency: Clear; Power Dissipation: 75mW; Test Current: 20mA; Lens Style: Rectangular,Colorless; Reverse Voltage: 5V; Lens Color: Colorless; Forward Current: 30mA; Dominant Wavelength: 571nm; Forward Voltage: 2V; Luminous Intensity: 35mcd; Case Code (Imperial): 0603; Width: 0.8mm; Depth: 0.8mm; Case Code (Metric): 1608; Packaging: Tape and Reel; Number of LEDs: 1; Lead Free: Lead Free; Package Quantity: 1; Illumination Color: Green; Design Item ID: LTST-C191KGKT; Color: Green; Mount: Surface Mount; Source: Diodes.SchLib; Radiation Hardening: No; Wavelength: 574nm; RoHS: Yes; Max Power Dissipation: 75mW; RoHS Compliant: Yes; Power Rating: 75mW; Case/Package: 0603; Length: 1.6mm; Component Type: Standard; Number of Pins: 2; Height: 0.55mm; Stock 1: 4150; Pin Count: 2; ComponentLink1Description: https://datasheet.ciiva.com/2109/ltst-c191kgkt-2109973.pdf?src-supplier=Digi-Key; Manufacturer Part Number 1: LTST-C191KGKT; Category: LEDs; Min Operating Temperature: -55°C; ComponentLink1URL: https://datasheet.ciiva.com/2109/ltst-c191kgkt-2109973.pdf?src-supplier=Digi-Key; Max Operating Temperature: 85°C; Pricing 1: 50=0.14800, 250=0.06800, 500=0.06400, 1250=0.05400, 2500=0.05100 (USD)
R2-R10 R19 R60 R63-R70 = Generic Resistor: Tolerance: 1%; Power: 1/10W
R20 R21 = Generic Resistor: Tolerance: 1%
U1 U3-U6 U9 U18 = USB6B1RL: TVS DIODE 5.25VWM 8-SOIC; Mfr_Name: STMicroelectronics; RefDes: RefDes; Type: Type; Supplier 1: Future Electronics; Supplier Part Number 1: 5702279; LCSC PN: C10508
U8 = FSUSB42MUX: FSUSB42 Series DPDT 4.3 V 480 Mbps SMT Hi Speed USB 2.0 Switch - MSOP-10; MF: ON Semiconductor; SnapEDA_Link: https://www.snapeda.com/parts/FSUSB42MUX/Onsemi/view-part/?ref=snap; Package: MSOP-10 ON Semiconductor; Value: *; MP: FSUSB42MUX; Check_prices: https://www.snapeda.com/parts/FSUSB42MUX/Onsemi/view-part/?ref=eda; LCSC PN: C11355; Supplier 1: Digikey; Supplier Part Number 1: FSUSB42MUXCT-ND
U23 = USB2517-JZX: USB Hub Controller USB 2.0 USB Interface 64-QFN (9x9); Mfr_Name: Microchip; RefDes: RefDes; Type: Type; LCSC PN: C1521556; Supplier 1: Avnet; Supplier Part Number 1: USB2517I-JZX; Supplier 2: Newark; Supplier Part Number 2: 66W2139; Supplier 3: Newark; Supplier Part Number 3: 41AH8631
Y1 = CM4024M00020001: 24MHz 20pF ±10ppm ±30ppm SMD-2520-4P Crystals ROHS; LCSC PN: C7294628

## Sheet Docking_Connection.SchDoc
size B; SheetNumber: 3; SheetTotal: 10
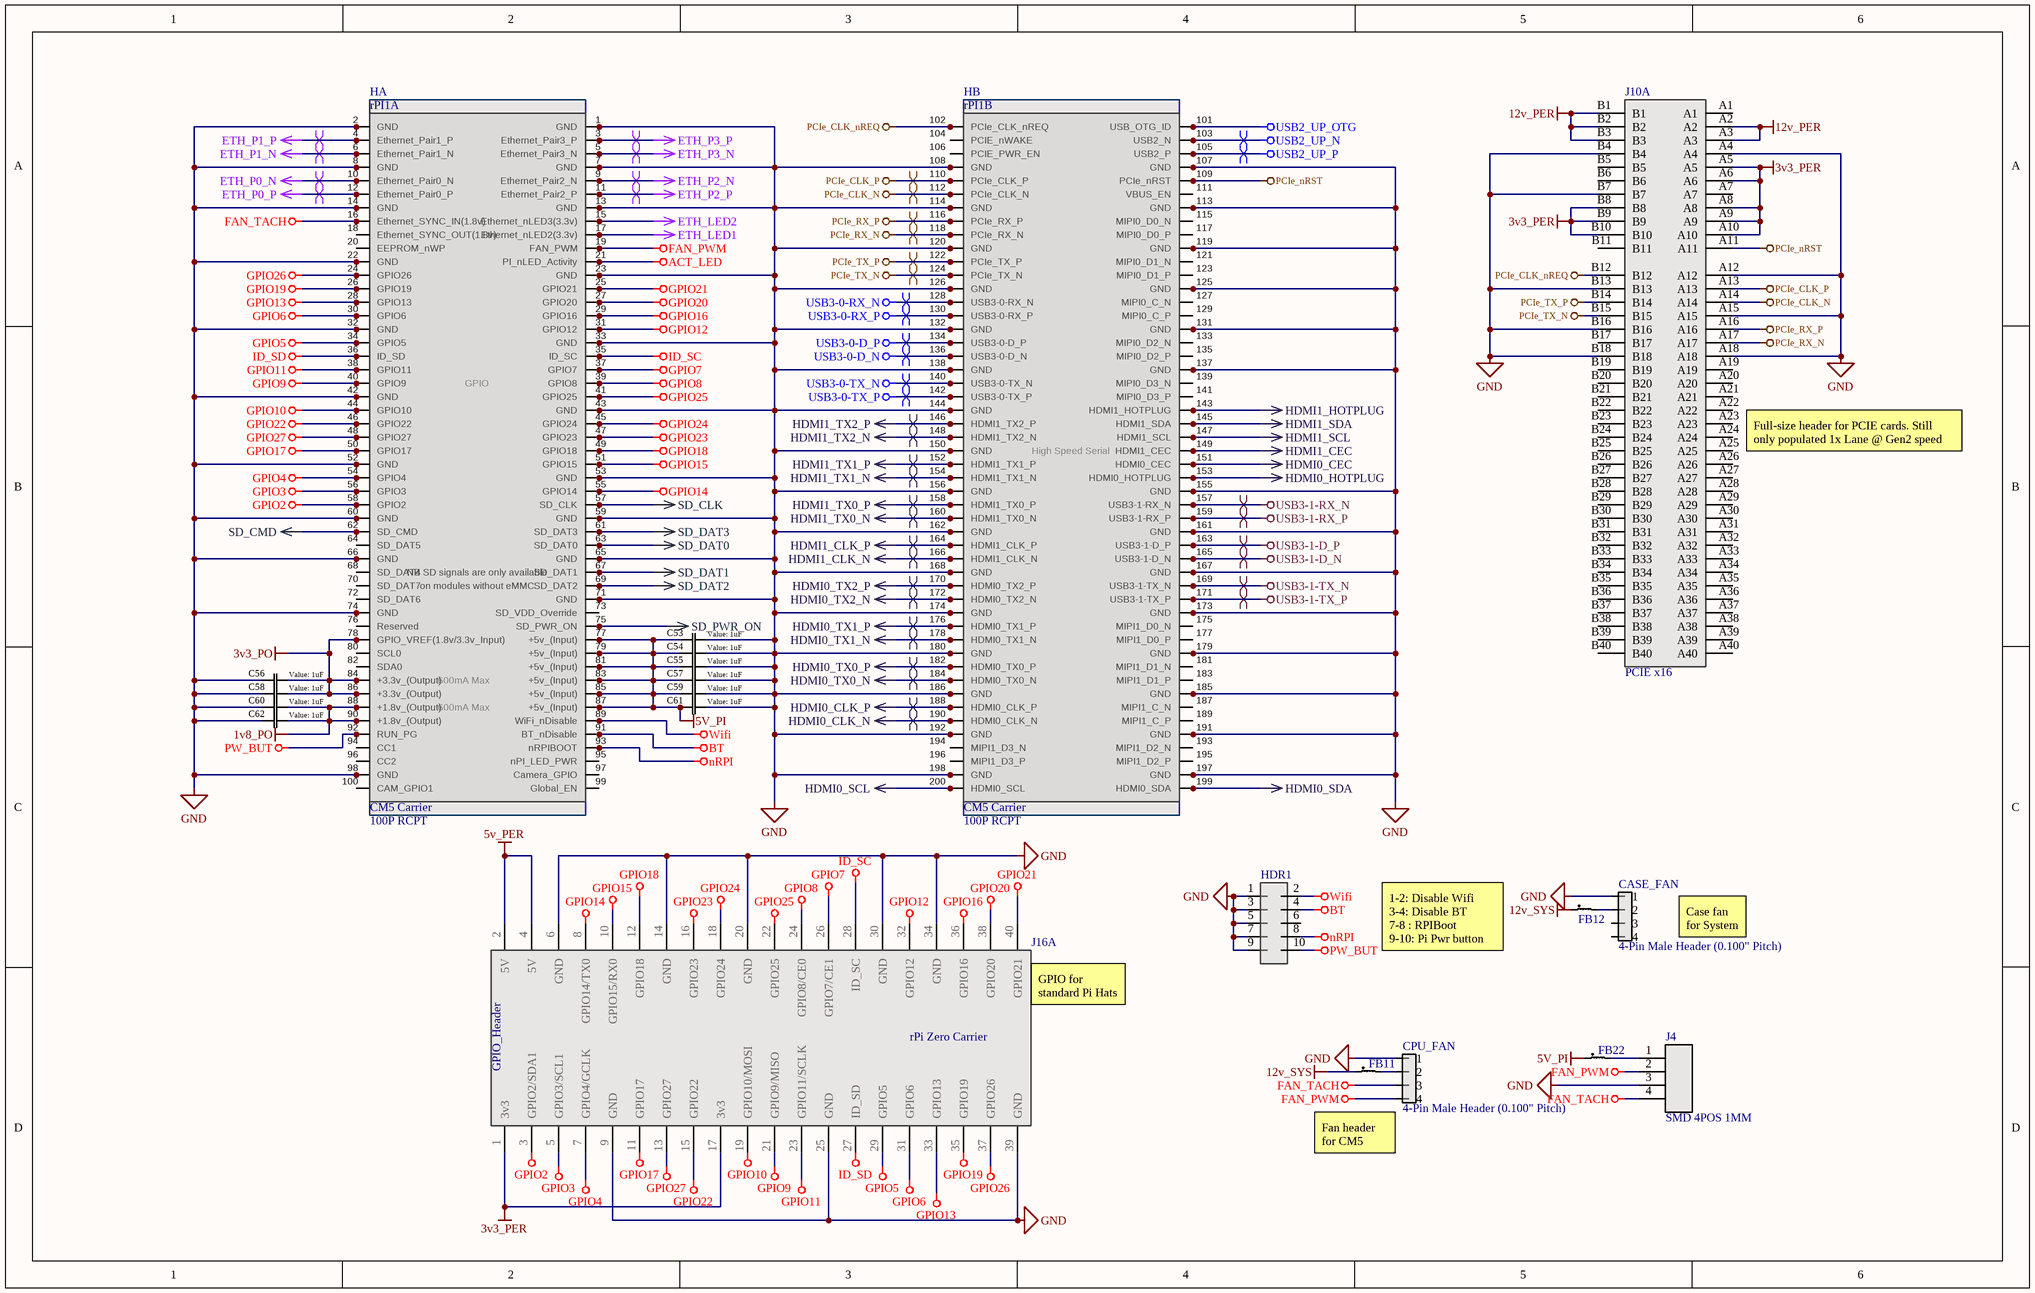
[diagram p3: Docking_Connection.SchDoc]

### Parts
C53  value 1uF  [0603]  (hidden comment: Generic Capacitor)
C54  value 1uF  [0603]  (hidden comment: Generic Capacitor)
C55  value 1uF  [0603]  (hidden comment: Generic Capacitor)
C56  value 1uF  [0603]  (hidden comment: Generic Capacitor)
C57  value 1uF  [0603]  (hidden comment: Generic Capacitor)
C58  value 1uF  [0603]  (hidden comment: Generic Capacitor)
C59  value 1uF  [0603]  (hidden comment: Generic Capacitor)
C60  value 1uF  [0603]  (hidden comment: Generic Capacitor)
C61  value 1uF  [0603]  (hidden comment: Generic Capacitor)
C62  value 1uF  [0603]  (hidden comment: Generic Capacitor)
CASE_FAN  4-Pin Male Header (0.100" Pitch)  [TSW-104-07-T-S]
CPU_FAN  4-Pin Male Header (0.100" Pitch)  [TSW-104-07-T-S]
FB11  0603 Ferrite  [0603]  (value not drawn)
FB12  0603 Ferrite  [0603]  (value not drawn)
FB22  0603 Ferrite  [0603]  (value not drawn)
HA  100P RCPT  [DF40HC(3.0)-100DS-0.4V(51)]
HB  100P RCPT  [DF40HC(3.0)-100DS-0.4V(51)]
HDR1  10pinMobo  [10pinMobo]  (value not drawn)
J4  SMD 4POS 1MM  [CONN4_BM04B-SRSS_JST]
J10  PCIE x16  [10018783-10203TLF]  (part A of 2)
J16  rPi Zero Carrier  [rPiZero]  (part A of 2)
rPI1  CM5 Carrier  [CM4-FTPD]  (parts A,B of 2)

### Nets
1v8_PO: C60.1 C62.1 HA.88 HA.90 rPI1.88(+1.8v_(Output)) rPI1.90(+1.8v_(Output))
3v3_PER: J10.A5 J10.A6 J10.A8 J10.A9 J10.A10 J10.B8 J10.B9 J10.B10 J16.1(3v3) J16.17(3v3)
3v3_PO: C56.1 C58.1 HA.78 HA.84 HA.86 rPI1.78(GPIO_VREF(1.8v/3.3v_Input)) rPI1.84(+3.3v_(Output)) rPI1.86(+3.3v_(Output))
5v_PER: J16.2(5V) J16.4(5V)
5V_PI: C53.2 C54.2 C55.2 C57.2 C59.2 C61.2 FB22.1 HA.77 HA.79 HA.81 HA.83 HA.85 HA.87 rPI1.77(+5v_(Input)) rPI1.79(+5v_(Input)) rPI1.81(+5v_(Input)) rPI1.83(+5v_(Input)) rPI1.85(+5v_(Input)) rPI1.87(+5v_(Input))
12v_PER: J10.A2 J10.A3 J10.B1 J10.B2 J10.B3
12v_SYS: FB11.1 FB12.1
ACT_LED: HA.21 rPI1.21(PI_nLED_Activity)
BT: HA.91 HDR1.4 rPI1.91(BT_nDisable)
ETH_LED1: HA.17 rPI1.17(Ethernet_nLED2(3.3v))
ETH_LED2: HA.15 rPI1.15(Ethernet_nLED3(3.3v))
ETH_P0_N: HA.10 rPI1.10(Ethernet_Pair0_N)
ETH_P0_P: HA.12 rPI1.12(Ethernet_Pair0_P)
ETH_P1_N: HA.6 rPI1.6(Ethernet_Pair1_N)
ETH_P1_P: HA.4 rPI1.4(Ethernet_Pair1_P)
ETH_P2_N: HA.9 rPI1.9(Ethernet_Pair2_N)
ETH_P2_P: HA.11 rPI1.11(Ethernet_Pair2_P)
ETH_P3_N: HA.5 rPI1.5(Ethernet_Pair3_N)
ETH_P3_P: HA.3 rPI1.3(Ethernet_Pair3_P)
FAN_PWM: CPU_FAN.4 HA.19 J4.2 rPI1.19(FAN_PWM)
FAN_TACH: CPU_FAN.3 HA.16 J4.4 rPI1.16(Ethernet_SYNC_IN(1.8v))
GND: C53.1 C54.1 C55.1 C56.2 C57.1 C58.2 C59.1 C60.2 C61.1 C62.2 CASE_FAN.1 CPU_FAN.1 HA.1 HA.2 HA.7 HA.8 HA.13 HA.14 HA.22 HA.23 HA.32 HA.33 HA.42 HA.43 HA.52 HA.53 HA.59 HA.60 HA.65 HA.66 HA.71 HA.74 HA.98 HB.7 HB.8 HB.13 HB.14 HB.19 HB.20 HB.25 HB.26 HB.31 HB.32 HB.37 HB.38 HB.44 HB.50 HB.55 HB.56 HB.61 HB.62 HB.67 HB.68 HB.73 HB.74 HB.79 HB.80 HB.85 HB.86 HB.91 HB.92 HB.97 HB.98 HDR1.1 HDR1.3 HDR1.5 HDR1.7 HDR1.9 J4.3 J10.A4 J10.A12 J10.A15 J10.A18 J10.B4 J10.B7 J10.B13 J10.B16 J10.B18 J16.6(GND) J16.9(GND) J16.14(GND) J16.20(GND) J16.25(GND) J16.30(GND) J16.34(GND) J16.39(GND) rPI1.1(GND) rPI1.2(GND) rPI1.7(GND) rPI1.8(GND) rPI1.13(GND) rPI1.14(GND) rPI1.22(GND) rPI1.23(GND) rPI1.32(GND) rPI1.33(GND) rPI1.42(GND) rPI1.43(GND) rPI1.52(GND) rPI1.53(GND) rPI1.59(GND) rPI1.60(GND) rPI1.65(GND) rPI1.66(GND) rPI1.71(GND) rPI1.74(GND) rPI1.98(GND) rPI1.107(GND) rPI1.108(GND) rPI1.113(GND) rPI1.114(GND) rPI1.119(GND) rPI1.120(GND) rPI1.125(GND) rPI1.126(GND) rPI1.131(GND) rPI1.132(GND) rPI1.137(GND) rPI1.138(GND) rPI1.144(GND) rPI1.150(GND) rPI1.155(GND) rPI1.156(GND) rPI1.161(GND) rPI1.162(GND) rPI1.167(GND) rPI1.168(GND) rPI1.173(GND) rPI1.174(GND) rPI1.179(GND) rPI1.180(GND) rPI1.185(GND) rPI1.186(GND) rPI1.191(GND) rPI1.192(GND) rPI1.197(GND) rPI1.198(GND)
GPIO2: HA.58 J16.3(GPIO2/SDA1) rPI1.58(GPIO2)
GPIO3: HA.56 J16.5(GPIO3/SCL1) rPI1.56(GPIO3)
GPIO4: HA.54 J16.7(GPIO4/GCLK) rPI1.54(GPIO4)
GPIO5: HA.34 J16.29(GPIO5) rPI1.34(GPIO5)
GPIO6: HA.30 J16.31(GPIO6) rPI1.30(GPIO6)
GPIO7: HA.37 J16.26(GPIO7/CE1) rPI1.37(GPIO7)
GPIO8: HA.39 J16.24(GPIO8/CE0) rPI1.39(GPIO8)
GPIO9: HA.40 J16.21(GPIO9/MISO) rPI1.40(GPIO9)
GPIO10: HA.44 J16.19(GPIO10/MOSI) rPI1.44(GPIO10)
GPIO11: HA.38 J16.23(GPIO11/SCLK) rPI1.38(GPIO11)
GPIO12: HA.31 J16.32(GPIO12) rPI1.31(GPIO12)
GPIO13: HA.28 J16.33(GPIO13) rPI1.28(GPIO13)
GPIO14: HA.55 J16.8(GPIO14/TX0) rPI1.55(GPIO14)
GPIO15: HA.51 J16.10(GPIO15/RX0) rPI1.51(GPIO15)
GPIO16: HA.29 J16.36(GPIO16) rPI1.29(GPIO16)
GPIO17: HA.50 J16.11(GPIO17) rPI1.50(GPIO17)
GPIO18: HA.49 J16.12(GPIO18) rPI1.49(GPIO18)
GPIO19: HA.26 J16.35(GPIO19) rPI1.26(GPIO19)
GPIO20: HA.27 J16.38(GPIO20) rPI1.27(GPIO20)
GPIO21: HA.25 J16.40(GPIO21) rPI1.25(GPIO21)
GPIO22: HA.46 J16.15(GPIO22) rPI1.46(GPIO22)
GPIO23: HA.47 J16.16(GPIO23) rPI1.47(GPIO23)
GPIO24: HA.45 J16.18(GPIO24) rPI1.45(GPIO24)
GPIO25: HA.41 J16.22(GPIO25) rPI1.41(GPIO25)
GPIO26: HA.24 J16.37(GPIO26) rPI1.24(GPIO26)
GPIO27: HA.48 J16.13(GPIO27) rPI1.48(GPIO27)
HDMI0_CEC: HB.51 rPI1.151(HDMI0_CEC)
HDMI0_CLK_N: HB.90 rPI1.190(HDMI0_CLK_N)
HDMI0_CLK_P: HB.88 rPI1.188(HDMI0_CLK_P)
HDMI0_HOTPLUG: HB.53 rPI1.153(HDMI0_HOTPLUG)
HDMI0_SCL: HB.100 rPI1.200(HDMI0_SCL)
HDMI0_SDA: HB.99 rPI1.199(HDMI0_SDA)
HDMI0_TX0_N: HB.84 rPI1.184(HDMI0_TX0_N)
HDMI0_TX0_P: HB.82 rPI1.182(HDMI0_TX0_P)
HDMI0_TX1_N: HB.78 rPI1.178(HDMI0_TX1_N)
HDMI0_TX1_P: HB.76 rPI1.176(HDMI0_TX1_P)
HDMI0_TX2_N: HB.72 rPI1.172(HDMI0_TX2_N)
HDMI0_TX2_P: HB.70 rPI1.170(HDMI0_TX2_P)
HDMI1_CEC: HB.49 rPI1.149(HDMI1_CEC)
HDMI1_CLK_N: HB.66 rPI1.166(HDMI1_CLK_N)
HDMI1_CLK_P: HB.64 rPI1.164(HDMI1_CLK_P)
HDMI1_HOTPLUG: HB.43 rPI1.143(HDMI1_HOTPLUG)
HDMI1_SCL: HB.47 rPI1.147(HDMI1_SCL)
HDMI1_SDA: HB.45 rPI1.145(HDMI1_SDA)
HDMI1_TX0_N: HB.60 rPI1.160(HDMI1_TX0_N)
HDMI1_TX0_P: HB.58 rPI1.158(HDMI1_TX0_P)
HDMI1_TX1_N: HB.54 rPI1.154(HDMI1_TX1_N)
HDMI1_TX1_P: HB.52 rPI1.152(HDMI1_TX1_P)
HDMI1_TX2_N: HB.48 rPI1.148(HDMI1_TX2_N)
HDMI1_TX2_P: HB.46 rPI1.146(HDMI1_TX2_P)
ID_SC: HA.35 J16.28(ID_SC) rPI1.35(ID_SC)
ID_SD: HA.36 J16.27(ID_SD) rPI1.36(ID_SD)
nRPI: HA.93 HDR1.8 rPI1.93(nRPIBOOT)
PCIe_CLK_N: HB.12 J10.A14 rPI1.112(PCIe_CLK_N)
PCIe_CLK_nREQ: HB.2 J10.B12 rPI1.102(PCIe_CLK_nREQ)
PCIe_CLK_P: HB.10 J10.A13 rPI1.110(PCIe_CLK_P)
PCIe_nRST: HB.9 J10.A11 rPI1.109(PCIe_nRST)
PCIe_RX_N: HB.18 J10.A17 rPI1.118(PCIe_RX_N)
PCIe_RX_P: HB.16 J10.A16 rPI1.116(PCIe_RX_P)
PCIe_TX_N: HB.24 J10.B15 rPI1.124(PCIe_TX_N)
PCIe_TX_P: HB.22 J10.B14 rPI1.122(PCIe_TX_P)
PW_BUT: HA.92 HDR1.10 rPI1.92(RUN_PG)
SD_CLK: HA.57 rPI1.57(SD_CLK)
SD_CMD: HA.62 rPI1.62(SD_CMD)
SD_DAT0: HA.63 rPI1.63(SD_DAT0)
SD_DAT1: HA.67 rPI1.67(SD_DAT1)
SD_DAT2: HA.69 rPI1.69(SD_DAT2)
SD_DAT3: HA.61 rPI1.61(SD_DAT3)
SD_PWR_ON: HA.75 rPI1.75(SD_PWR_ON)
USB2_UP_N: HB.3 rPI1.103(USB2_N)
USB2_UP_OTG: HB.1 rPI1.101(USB_OTG_ID)
USB2_UP_P: HB.5 rPI1.105(USB2_P)
USB3-0-D_N: HB.36 rPI1.136(USB3-0-D_N)
USB3-0-D_P: HB.34 rPI1.134(USB3-0-D_P)
USB3-0-RX_N: HB.28 rPI1.128(USB3-0-RX_N)
USB3-0-RX_P: HB.30 rPI1.130(USB3-0-RX_P)
USB3-0-TX_N: HB.40 rPI1.140(USB3-0-TX_N)
USB3-0-TX_P: HB.42 rPI1.142(USB3-0-TX_P)
USB3-1-D_N: HB.65 rPI1.165(USB3-1-D_N)
USB3-1-D_P: HB.63 rPI1.163(USB3-1-D_P)
USB3-1-RX_N: HB.57 rPI1.157(USB3-1-RX_N)
USB3-1-RX_P: HB.59 rPI1.159(USB3-1-RX_P)
USB3-1-TX_N: HB.69 rPI1.169(USB3-1-TX_N)
USB3-1-TX_P: HB.71 rPI1.171(USB3-1-TX_P)
Wifi: HA.89 HDR1.2 rPI1.89(WiFi_nDisable)
NetCASE_FAN_2: CASE_FAN.2 FB12.2
NetCPU_FAN_2: CPU_FAN.2 FB11.2
NetFB22_2: FB22.2 J4.1
NetHA_18: HA.18 rPI1.18(Ethernet_SYNC_OUT(1.8v))
NetHA_20: HA.20 rPI1.20(EEPROM_nWP)
NetHA_64: HA.64 rPI1.64(SD_DAT5)
NetHA_68: HA.68 rPI1.68(SD_DAT4)
NetHA_70: HA.70 rPI1.70(SD_DAT7)
NetHA_72: HA.72 rPI1.72(SD_DAT6)
NetHA_73: HA.73 rPI1.73(SD_VDD_Override)
NetHA_76: HA.76 rPI1.76(Reserved)
NetHA_80: HA.80 rPI1.80(SCL0)
NetHA_82: HA.82 rPI1.82(SDA0)
NetHA_94: HA.94 rPI1.94(CC1)
NetHA_95: HA.95 rPI1.95(nPI_LED_PWR)
NetHA_96: HA.96 rPI1.96(CC2)
NetHA_97: HA.97 rPI1.97(Camera_GPIO)
NetHA_99: HA.99 rPI1.99(Global_EN)
NetHA_100: HA.100 rPI1.100(CAM_GPIO1)
NetHB_4: HB.4 rPI1.104(PCIE_nWAKE)
NetHB_6: HB.6 rPI1.106(PCIE_PWR_EN)
NetHB_11: HB.11 rPI1.111(VBUS_EN)
NetHB_15: HB.15 rPI1.115(MIPI0_D0_N)
NetHB_17: HB.17 rPI1.117(MIPI0_D0_P)
NetHB_21: HB.21 rPI1.121(MIPI0_D1_N)
NetHB_23: HB.23 rPI1.123(MIPI0_D1_P)
NetHB_27: HB.27 rPI1.127(MIPI0_C_N)
NetHB_29: HB.29 rPI1.129(MIPI0_C_P)
NetHB_33: HB.33 rPI1.133(MIPI0_D2_N)
NetHB_35: HB.35 rPI1.135(MIPI0_D2_P)
NetHB_39: HB.39 rPI1.139(MIPI0_D3_N)
NetHB_41: HB.41 rPI1.141(MIPI0_D3_P)
NetHB_75: HB.75 rPI1.175(MIPI1_D0_N)
NetHB_77: HB.77 rPI1.177(MIPI1_D0_P)
NetHB_81: HB.81 rPI1.181(MIPI1_D1_N)
NetHB_83: HB.83 rPI1.183(MIPI1_D1_P)
NetHB_87: HB.87 rPI1.187(MIPI1_C_N)
NetHB_89: HB.89 rPI1.189(MIPI1_C_P)
NetHB_93: HB.93 rPI1.193(MIPI1_D2_N)
NetHB_94: HB.94 rPI1.194(MIPI1_D3_N)
NetHB_95: HB.95 rPI1.195(MIPI1_D2_P)
NetHB_96: HB.96 rPI1.196(MIPI1_D3_P)

Not connected (* = marked no-connect by the designer): CASE_FAN 3 4; HDR1 6; J10 A1 A7 A19 A20 A21 A22 A23 A24 A25 A26 A27 A28 A29 A30 A31 A32 A33 A34 A35 A36 A37 A38 A39 A40 B5 B6 B11 B17 B19 B20 B21 B22 B23 B24 B25 B26 B27 B28 B29 B30 B31 B32 B33 B34 B35 B36 B37 B38 B39 B40

### Layout directives
differential pair: ETH_P0_N, ETH_P0_P, ETH_P1_N, ETH_P1_P, ETH_P2_N, ETH_P2_P, ETH_P3_N, ETH_P3_P, HDMI0_CLK_N, HDMI0_CLK_P, HDMI0_TX0_N, HDMI0_TX0_P, HDMI0_TX1_N, HDMI0_TX1_P, HDMI0_TX2_N, HDMI0_TX2_P, HDMI1_CLK_N, HDMI1_CLK_P, HDMI1_TX0_N, HDMI1_TX0_P, HDMI1_TX1_N, HDMI1_TX1_P, HDMI1_TX2_N, HDMI1_TX2_P, PCIe_CLK_N, PCIe_CLK_P, PCIe_RX_N, PCIe_RX_P, PCIe_TX_N, PCIe_TX_P, USB2_UP_N, USB2_UP_P, USB3-0-D_N, USB3-0-D_P, USB3-0-RX_N, USB3-0-RX_P, USB3-0-TX_N, USB3-0-TX_P, USB3-1-D_N, USB3-1-D_P, USB3-1-RX_N, USB3-1-RX_P, USB3-1-TX_N, USB3-1-TX_P

### Notes on the sheet
- (near J10) Full-size header for PCIE cards. Still only populated 1x Lane @ Gen2 speed
- 1-2: Disable Wifi
  3-4: Disable BT
  7-8 : RPIBoot
  9-10: Pi Pwr button
- Case fan for System
- (near J16) GPIO for standard Pi Hats
- (near CPU_FAN) Fan header for CM5
- REV
- REVISIONS
- DATE
- DESCRIPTION
- BY
- UNLESS OTHERWISE SPECIFIED, DRAWING DEFINITIONS AND TOLERANCES SHALL BE FOUND UNDER SUPPLIER STANDARDS SS-001. THIS PART AND ALL COMPONENTS OF IT MUST BE RoHS & REACH COMPLIANT. A CERTIFICATE OF COMPLIANCE MUST BE PROVIDED UPON REQUEST.
- ALL INFORMATION ON THIS DOCUMENT IS THE SOLE PROPERTY OF GAMBER-JOHNSON AND SHALL NOT BE COPIED, REPRODUCED, USED OR DISCLOSED IN WHOLE OR IN PART WITHOUT THE WRITTEN CONSENT OF GAMBER-JOHNSON
- TOLERANCES
  .00 ± .060
  .000 ± .020
  .0000 ± .005
  ANGELS ± 1°
- DRAWN BY:
- PROJECT NUMBER:
- SHEET TITLE:
- SHEET
- OF
- DATE:
- LOCATION:
- ASSEMBLY NUMBER
- SIZE
- GAMBER-JOHNSON LLC
  5001 JOERNS DR.
  STEVENS POINT, WI 54481
  +1 (715) 344-5209
- B
- (in symbol RP-CM5, part A) GPIO; NB SD signals are only available; on modules without eMMC; 600mA Max
- (in symbol RP-CM5, part B) High Speed Serial
- (in symbol RP-Zero, part A) GPIO_Header

### Library data of the parts
C53-C62 = Generic Capacitor: Voltage: 6V; Tolerance: 5%
CASE_FAN CPU_FAN = TSW-104-07-T-S: as PWR on sheet Power_Regulation; Supplier 1: Avnet; RoHS: Yes; Category: Connectors; Mount: Through Hole; Contact Plating: Tin; Contact Material: Bronze; Min Operating Temperature: -55°C; Max Operating Temperature: 105°C; Number of Rows: 1; Termination: Solder; Gender: Male; Packaging: Bulk; Orientation: Vertical; Pitch: 2.54mm; Radiation Hardening: No; RoHS Compliant: Yes; Lead Free: Lead Free; ComponentLink1URL: http://www.samtec.com/documents/webfiles/pdf/HMTSW.PDF?src-supplier=Avnet; ComponentLink1Description: http://www.samtec.com/documents/webfiles/pdf/HMTSW.PDF?src-supplier=Avnet; Supplier Part Number 1: MTSW-104-07-T-S-170
FB11 FB12 FB22 = PE-0603FB121ST: as FB1 on sheet USB2_Replication; Supplier 1: Digi-Key; Supplier Part Number 1: 553-2382-1-ND; Manufacturer Part Number: PE-0603FB121ST; RoHS: Yes; Category: Inductors; Stock 1: 6181; Pricing 1: 1=0.10000, 10=0.04400, 25=0.03920, 50=0.03580, 100=0.03220, 250=0.02360, 500=0.01716, 1000=0.01680 (USD); Mount: Surface Mount; Case/Package: 0603; Case Code (Metric): 1608; Case Code (Imperial): 0603; Min Operating Temperature: -40°C; Max Operating Temperature: 105°C; Package Quantity: 4000; Packaging: Tape and Reel; Max Current Rating: 500mA; Length: 0.063inch; Width: 0.031inch; Height: 0.037inch; RoHS Compliant: Yes; ComponentLink1URL: https://productfinder.pulseeng.com/doc_type/WEB301/doc_num/WC706/doc_part/WC706.pdf?src-supplier=Digi-Key; ComponentLink1Description: https://productfinder.pulseeng.com/doc_type/WEB301/doc_num/WC706/doc_part/WC706.pdf?src-supplier=Digi-Key; ComponentLink2URL: http://productfinder.pulseeng.com/products/datasheets/WC706.pdf?src-supplier=Digi-Key; ComponentLink2Description: http://productfinder.pulseeng.com/products/datasheets/WC706.pdf?src-supplier=Digi-Key; LCSC PN: C275486
HA HB = DF40-100DS RCPT_1: 100 Position Connector Receptacle, Center Strip Contacts Surface Mount Gold; MF: Hirose; MP: DF40C-100DS-0.4V(51); SnapEDA_Link: https://www.snapeda.com/parts/DF40C-100DS-0.4V(51)/Hirose/view-part/?ref=snap; Package: None; Value: *; Check_prices: https://www.snapeda.com/parts/DF40C-100DS-0.4V(51)/Hirose/view-part/?ref=eda; LCSC PN: C424649; Supplier 1: Avnet; Supplier Part Number 1: DF40C-100DS-0.4V(5; Supplier 2: Digikey; Supplier Part Number 2: 26-DF40HC(3.0)-100DS-0.4V(51)CT-ND
HDR1 = 10pinMobo: 10pin motherboard jack
J4 = BM04B-SRSS-TB: Connector Header Surface Mount 4 position 0.039" (1.00mm); Mfr_Name: JST; Type: Headers, Male Pins; RefDes: RefDes
J10 = 10018783-10203TLF: 164 Position Female Connector PCI Express™ Gold 0.039" (1.00mm) Black; MF: Amphenol ICC; Package: None; Price: None; Value: *; MP: 10018783-10203TLF; Availability: Unavailable; LCSC PN: C426228; Supplier 1: Avnet; Supplier Part Number 1: 73P6874
J16 = RP-Zero: Raspberry Pi Zero/W/2W / Header, debug-pads, & mounting
rPI1 = RP-CM5: Compute Module 5 Footprint / Overlap Hirose 100P connector over pads to place actual components

## Sheet RJ45_Ethernet.SchDoc
size A; SheetNumber: 6; SheetTotal: 9
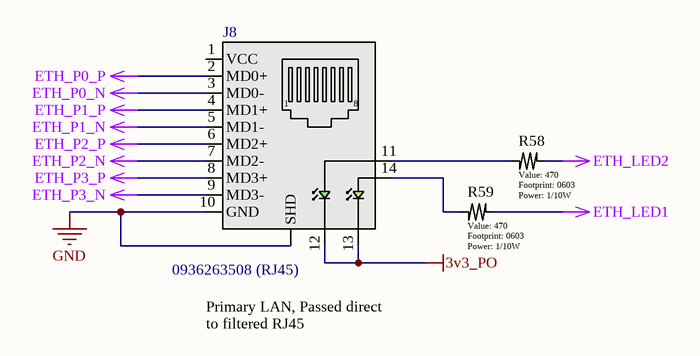
[diagram p4: RJ45_Ethernet.SchDoc]

### Parts
J8  0936263508 (RJ45)  [0936263508]
R58  value 470  Power: 1/10W  [0603]  (hidden comment: Generic Resistor)
R59  value 470  Power: 1/10W  [0603]  (hidden comment: Generic Resistor)

### Nets
3v3_PO: J8.12(Cathode) J8.13(Cathode)
ETH_LED1: R59.2
ETH_LED2: R58.2
ETH_P0_N: J8.3(MD0-)
ETH_P0_P: J8.2(MD0+)
ETH_P1_N: J8.5(MD1-)
ETH_P1_P: J8.4(MD1+)
ETH_P2_N: J8.7(MD2-)
ETH_P2_P: J8.6(MD2+)
ETH_P3_N: J8.9(MD3-)
ETH_P3_P: J8.8(MD3+)
GND: J8.10(GND) J8.SHD
NetJ8_11: J8.11(Anode) R58.1
NetJ8_14: J8.14(Anode) R59.1

Not connected (* = marked no-connect by the designer): J8 1(VCC)

### Notes on the sheet
- Primary LAN, Passed direct to filtered RJ45
- REV
- REVISIONS
- DATE
- DESCRIPTION
- BY
- UNLESS OTHERWISE SPECIFIED, DRAWING DEFINITIONS AND TOLERANCES SHALL BE FOUND UNDER SUPPLIER STANDARDS SS-001. THIS PART AND ALL COMPONENTS OF IT MUST BE RoHS & REACH COMPLIANT. A CERTIFICATE OF COMPLIANCE MUST BE PROVIDED UPON REQUEST.
- ALL INFORMATION ON THIS DOCUMENT IS THE SOLE PROPERTY OF GAMBER-JOHNSON AND SHALL NOT BE COPIED, REPRODUCED, USED OR DISCLOSED IN WHOLE OR IN PART WITHOUT THE WRITTEN CONSENT OF GAMBER-JOHNSON
- TOLERANCES
  .00 ± .060
  .000 ± .020
  .0000 ± .005
  ANGELS ± 1°
- DRAWN BY:
- PROJECT NUMBER:
- SHEET TITLE:
- SHEET
- OF
- DATE:
- LOCATION:
- ASSEMBLY NUMBER
- SIZE
- GAMBER-JOHNSON LLC
  5001 Joerns Dr
  STEVENS POINT, WI 54481
  +1 (715) 344-5209
- A

### Library data of the parts
J8 = 0936263508  (RJ45): 1 Port RJ45Through Hole 10/100/1000 Base-T, AutoMDIX; Manufacturer 1: Molex; Direction: Down; Number of Ports: 1; Number of Cores per Jack: 8; Shielding: Shielded; Supplier 1: Digi-Key; Manufacturer Part Number 1: 0936263508; RoHS: Yes; Category: Modular / Ethernet Connectors; Stock 1: 835; Pricing 1: 1=4.82000, 10=4.23800, 112=3.37134, 2408=2.60074 (USD); Mount: Through Hole; Color: Green,Yellow; Contact Material: Bronze; Contact Plating: Gold; Housing Material: Polymer; Min Operating Temperature: 0°C; Max Operating Temperature: 70°C; Connector Type: RJ45; Packaging: Tray; Number of Rows: 1; Termination: Solder; RoHS Compliant: Yes; ComponentLink1URL: https://www.molex.com/pdm_docs/sd/936263508_sd.pdf?src-supplier=Digi-Key; ComponentLink1Description: https://www.molex.com/pdm_docs/sd/936263508_sd.pdf?src-supplier=Digi-Key; Supplier Part Number 1: WM17616-ND; LCSC PN: C54408
R58 R59 = Generic Resistor: Tolerance: 1%